# Altium schematic sheet RTC.SchDoc
size A; SheetNumber: 8; SheetTotal: 9
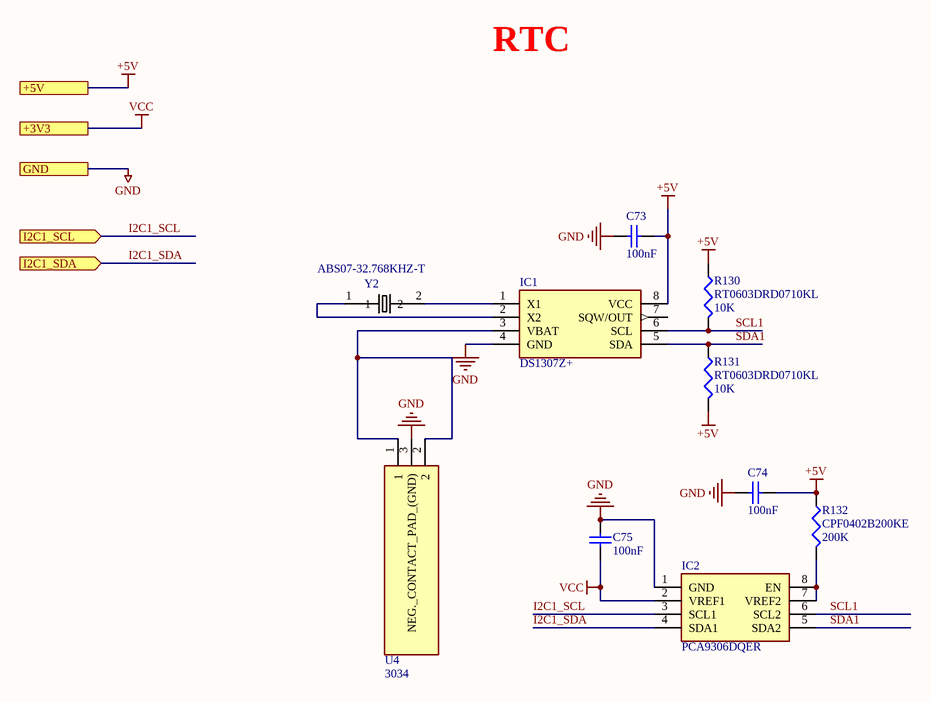
[diagram p0: RTC.SchDoc]

## Parts
C73  100nF  [CAPC1005X55X30LL05T10]
C74  100nF  [CAPC1005X55X30LL05T10]
C75  100nF  [CAPC1005X55X30LL05T10]
IC1  DS1307Z+  [S8-2_M]
IC2  PCA9306DQER  [FP-DQE0008A-MFG]
R130  RT0603DRD0710KL  value 10K  [J1-0603]
R131  RT0603DRD0710KL  value 10K  [J1-0603]
R132  CPF0402B200KE  value 200K  [0402]
U4  3034  [FP-3034-MFG]
Y2  ABS07-32.768KHZ-T  [FP-ABS07-MFG]

## Ports
+3V3, +5V, GND, I2C1_SCL (in), I2C1_SDA (in)

## Nets
+5V: C73.1 C74.1 IC1.8(VCC) R130.1 R131.2 R132.1 ; port +5V
GND: C73.2 C74.2 C75.2 IC1.4(GND) IC2.1(GND) U4.3(NEG._CONTACT_PAD_(GND)) ; port GND
VCC: C75.1 IC2.2(VREF1) ; port +3V3
I2C1_SCL: IC2.3(SCL1) ; port I2C1_SCL
I2C1_SDA: IC2.4(SDA1) ; port I2C1_SDA
SCL1: IC1.6(SCL) IC2.6(SCL2) R130.2
SDA1: IC1.5(SDA) IC2.5(SDA2) R131.1
NetIC1_1: IC1.1(X1) Y2.2
NetIC1_2: IC1.2(X2) Y2.1
NetIC1_3: IC1.3(VBAT) U4.1 U4.2
NetIC2_7: IC2.7(VREF2) IC2.8(EN) R132.2

Not connected (* = marked no-connect by the designer): IC1 7(SQW/OUT)

## Notes on the sheet
- RTC

## Library data of the parts
C73-C75 = CMP-0001-00074-2: Suuplier 1: Digi-Key; Supplier Part Number 1: 399-C0402C104K4RAC7867TR-ND
IC1 = DS1307Z+: Integrated Circuit; Manufacturer_Name: Maxim Integrated; Datasheet Link: http://datasheets.maximintegrated.com/en/ds/DS1307.pdf; Height: 1.75mm; Manufacturer_Part_Number: DS1307Z+; Mouser Part Number: 700-DS1307Z; Mouser Price/Stock: https://www.mouser.com/Search/Refine.aspx?Keyword=700-DS1307Z; RS Part Number: 1698316; RS Price/Stock: http://uk.rs-online.com/web/p/products/1698316; Supplier 1: Digi-Key; Supplier Part Number 1: DS1307Z+-ND
IC2 = PCA9306DQER: Integrated Circuit; Manufacturer_Name: Texas Instruments; Datasheet Link: http://www.ti.com/lit/ds/symlink/pca9306.pdf; Height: 0.4mm; Manufacturer_Part_Number: PCA9306DQER; Arrow Part Number: PCA9306DQER; Arrow Price/Stock: https://www.arrow.com/en/products/pca9306dqer/texas-instruments; Mouser Part Number: 595-PCA9306DQER; Mouser Price/Stock: https://www.mouser.co.uk/ProductDetail/Texas-Instruments/PCA9306DQER?qs=g5raLcSarOb3s8X2FUFJYw%3D%3D; Supplier 1: Digi-Key; Supplier Part Number 1: 296-27957-2-ND
R130-R132 = Res3: Resistor; Published: 8-Jun-2000; LatestRevisionDate: 29-May-2009; LatestRevisionNote: IPC-7351 Footprint Added.; PackageReference: J1-0603; Publisher: Altium Limited; PackageDescription: Chip Resistor; Supplier 1: Digi-Key
  R130 R131: Supplier Part Number 1: 311-10KDTR-ND
  R132: Supplier Part Number 1: A119933TR-ND
U4 = 3034: CR2032 COINCELL 3V BATTERY Holder; Manufacturer_Name: Keystone Electronics; Datasheet Link: http://www.keyelco.com/product-pdf.cfm?p=798; Height: 4.06mm; Manufacturer_Part_Number: 3034; Arrow Part Number: 3034; Arrow Price/Stock: https://www.arrow.com/en/products/3034/keystone-electronics; Mouser Part Number: 534-3034; Mouser Price/Stock: https://www.mouser.co.uk/ProductDetail/Keystone-Electronics/3034?qs=LDXARy4xNQtGYr6pIAv90A%3D%3D; Supplier 1: Digi-Key; Supplier Part Number 1: 36-3034-ND
Y2 = ABS07-32.768KHZ-T: ABS07 Series 32.768 kHz Â±20 ppm 12.5 pF -40 to +85 Â°C SMT Low Profile Crystal; MF: Abracon; Package: SMD-2 Abracon; MP: ABS07-32.768KHZ-T; Availability: Good; Price: 0.54 USD; Value: *; Supplier 1: Digi-Key; Supplier Part Number 1: 535-9542-2-ND